# Altium schematic sheet Microcontroller.SchDoc
size 420 x 297 mm; Date: 10.01.2024; CheckedBy: Arda B.; DrawnBy: Arda Bozkurt; DocumentNumber: 4; Revision: 001; SheetNumber: 4; SheetTotal: 5; Department: HDD; Size: A3
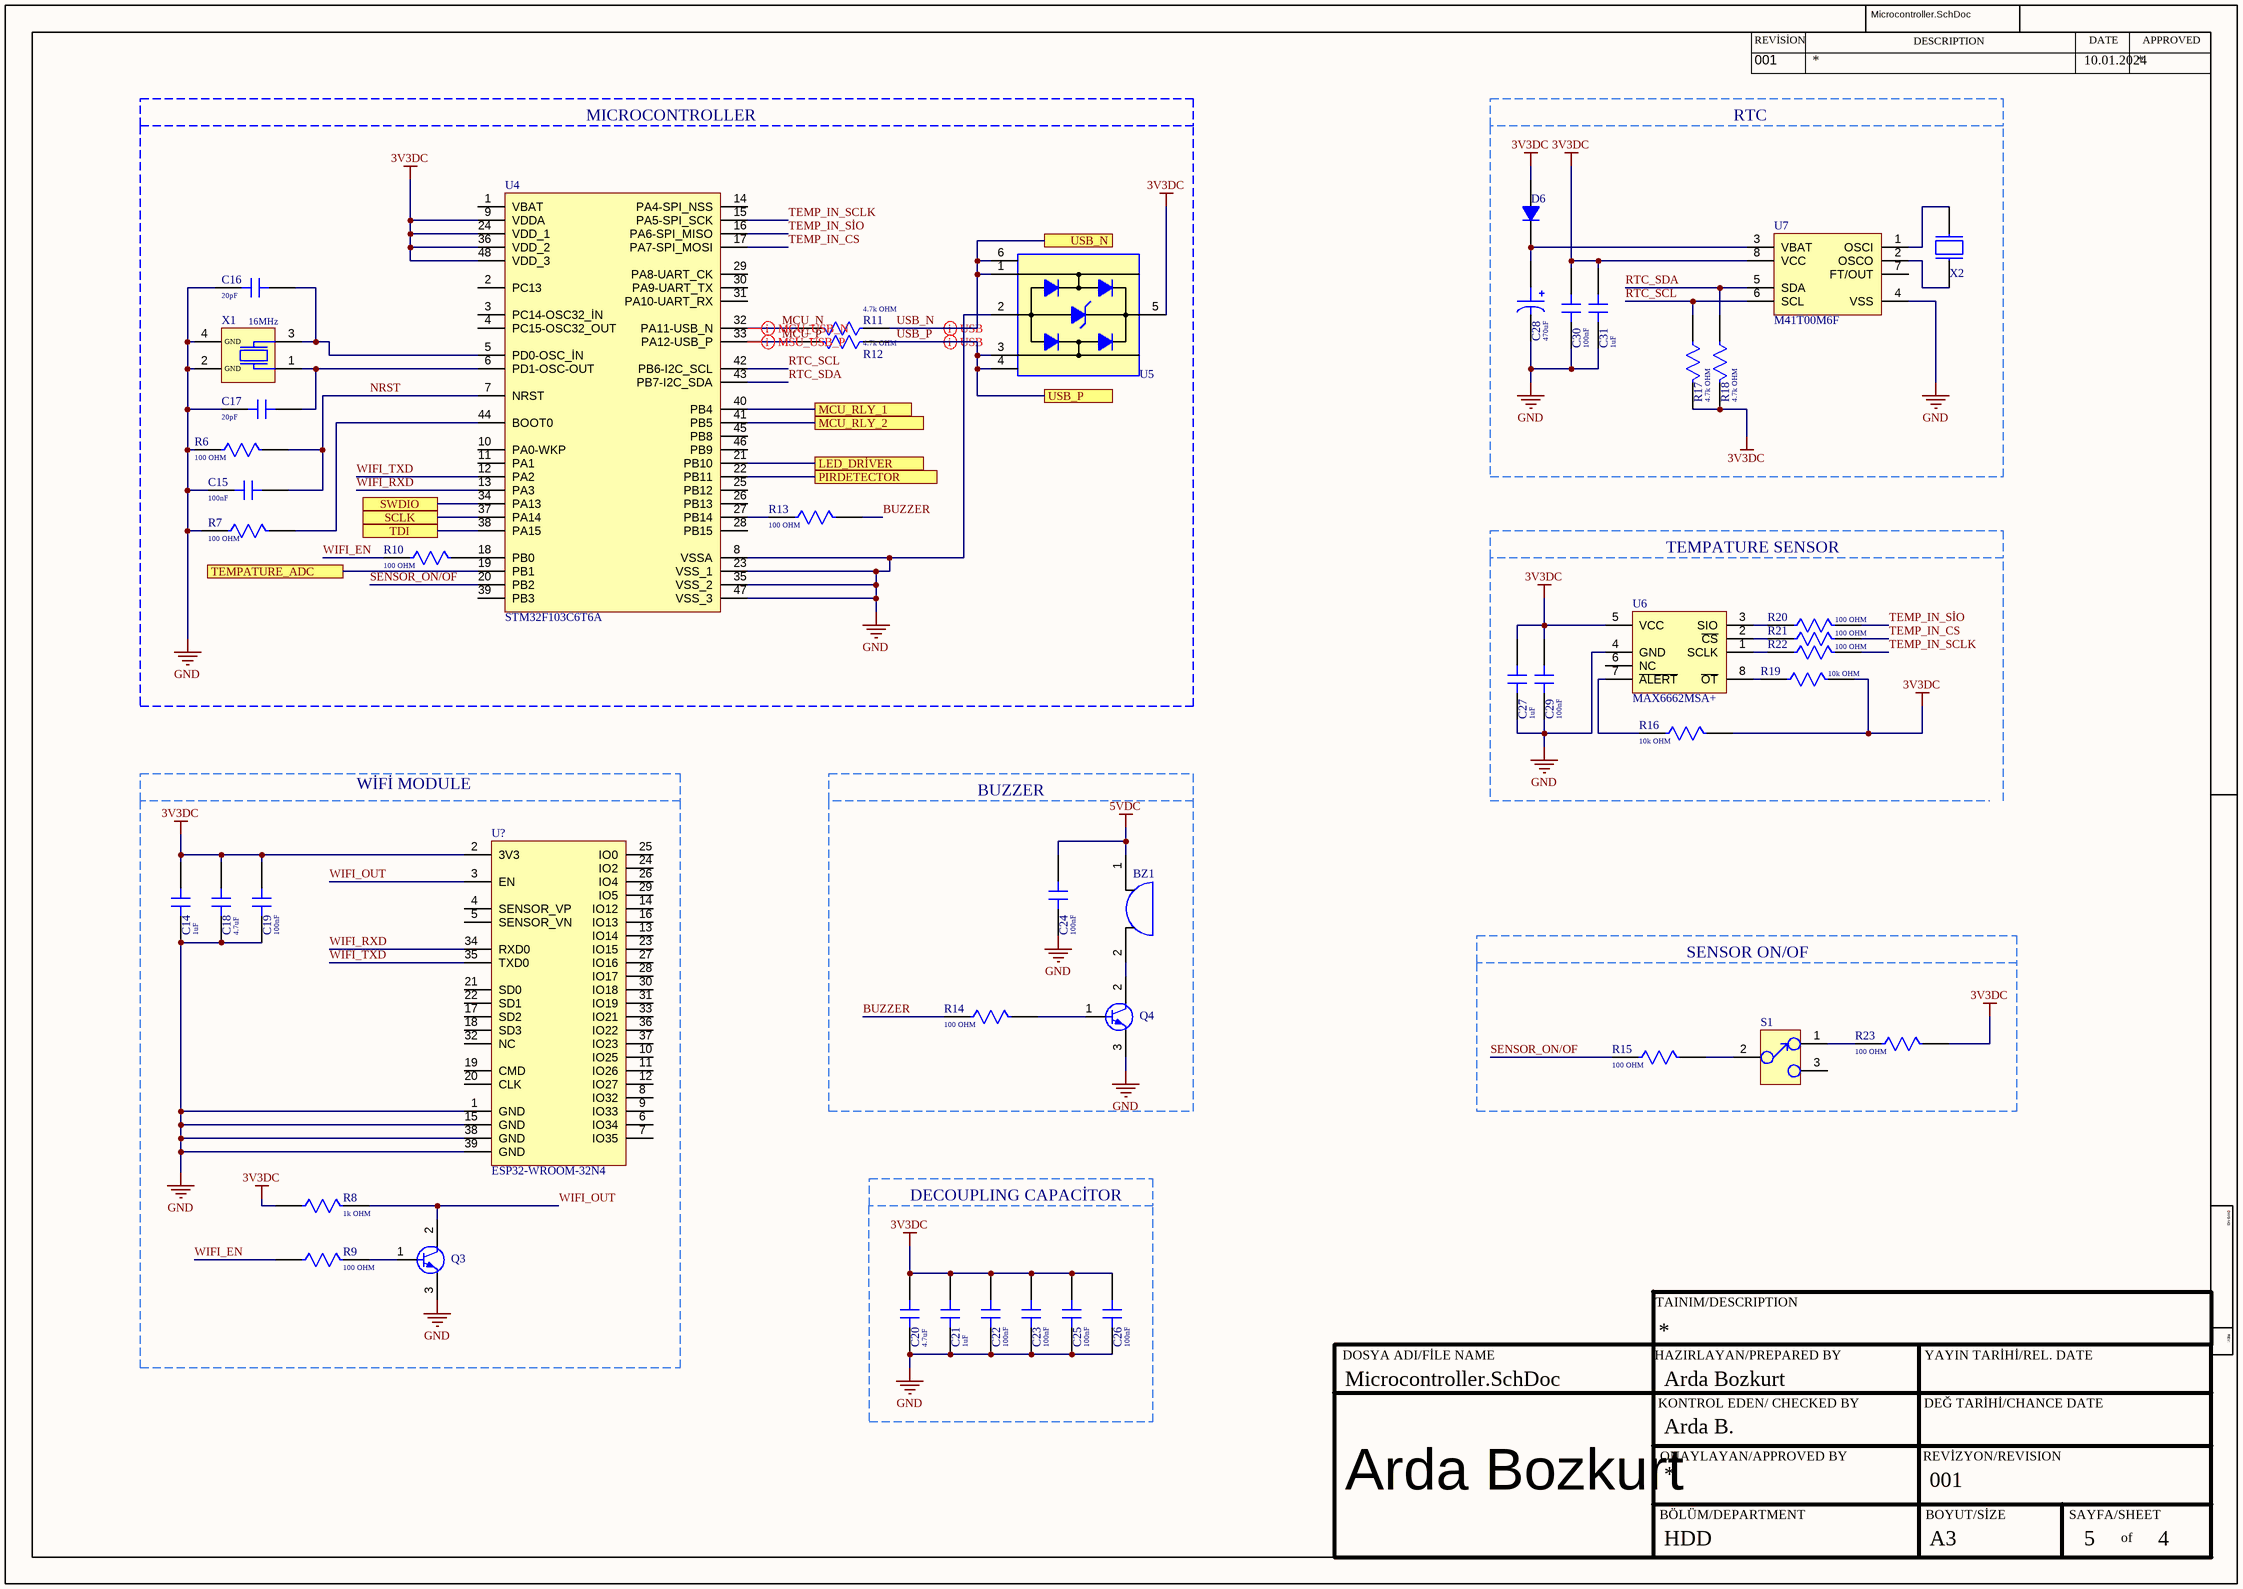
[diagram p0: Microcontroller.SchDoc]

## Parts
BZ1  CMI-9605IC-0580T  [CMI-9605IC-0580T]  (value not drawn)
C14  value 1uF  [CAP-0805]  (hidden comment: CL21B105KAFNNNE)
C15  value 100nF  [CAP-0603]  (hidden comment: C0603C104KRACTU)
C16  value 20pF  [CAP-0603]  (hidden comment: 0603N200J500CT)
C17  value 20pF  [CAP-0603]  (hidden comment: 0603N200J500CT)
C18  value 4.7uF  [CAP-0805]  (hidden comment: CL21A475KAQNNNE)
C19  value 100nF  [CAP-0805]  (hidden comment: 08055C104KAT2A)
C20  value 4.7uF  [CAP-0805]  (hidden comment: CL21A475KAQNNNE)
C21  value 1uF  [CAP-0805]  (hidden comment: CL21B105KAFNNNE)
C22  value 100nF  [CAP-0805]  (hidden comment: 08055C104KAT2A)
C23  value 100nF  [CAP-0805]  (hidden comment: 08055C104KAT2A)
C24  value 100nF  [CAP-0805]  (hidden comment: 08055C104KAT2A)
C25  value 100nF  [CAP-0805]  (hidden comment: 08055C104KAT2A)
C26  value 100nF  [CAP-0805]  (hidden comment: 08055C104KAT2A)
C27  value 1uF  [CAP-0805]  (hidden comment: CL21B105KAFNNNE)
C28  value 470uF  [CAP_RADİAL_D1_PS]  (hidden comment: ESH477M050AH4AA)
C29  value 100nF  [CAP-0805]  (hidden comment: 08055C104KAT2A)
C30  value 100nF  [CAP-0805]  (hidden comment: 08055C104KAT2A)
C31  value 1uF  [CAP-0805]  (hidden comment: CL21B105KAFNNNE)
D6  1N4148WS  [SOT-323]  (value not drawn)
Q3  MMBT3904-7-F  [SOT23-3]  (value not drawn)
Q4  MMBT3904-7-F  [SOT23-3]  (value not drawn)
R6  value 100 OHM  [RES-0603]  (hidden comment: RMCF0603FT100R)
R7  value 100 OHM  [RES-0603]  (hidden comment: RMCF0603FT100R)
R8  value 1k OHM  [RES-0603]  (hidden comment: RMCF0603FT1K00)
R9  value 100 OHM  [RES-0603]  (hidden comment: RMCF0603FT100R)
R10  value 100 OHM  [RES-0603]  (hidden comment: RMCF0603FT100R)
R11  value 4.7k OHM  [RES-0603]  (hidden comment: RMCF0603FT4K70)
R12  value 4.7k OHM  [RES-0603]  (hidden comment: RMCF0603FT4K70)
R13  value 100 OHM  [RES-0603]  (hidden comment: RMCF0603FT100R)
R14  value 100 OHM  [RES-0603]  (hidden comment: RMCF0603FT100R)
R15  value 100 OHM  [RES-0603]  (hidden comment: RMCF0603FT100R)
R16  value 10k OHM  [RES-0603]  (hidden comment: RC0603FR-0710KL)
R17  value 4.7k OHM  [RES-0603]  (hidden comment: RMCF0603FT4K70)
R18  value 4.7k OHM  [RES-0603]  (hidden comment: RMCF0603FT4K70)
R19  value 10k OHM  [RES-0603]  (hidden comment: RC0603FR-0710KL)
R20  value 100 OHM  [RES-0603]  (hidden comment: RMCF0603FT100R)
R21  value 100 OHM  [RES-0603]  (hidden comment: RMCF0603FT100R)
R22  value 100 OHM  [RES-0603]  (hidden comment: RMCF0603FT100R)
R23  value 100 OHM  [RES-0603]  (hidden comment: RMCF0603FT100R)
S1  EG1215AA  [SWİCH SLİDE]  (value not drawn)
U4  STM32F103C6T6A  [LQFP48]
U5  USBLC6-2SC6  [SOT23-6]  (value not drawn)
U6  MAX6662MSA+  [SO8]
U7  M41T00M6F  [SO8]
U?  ESP32-WROOM-32N4  [ESP32­WROOM­32-N4]
X1  Frequency: 16MHz  [ECX_53b]  (hidden comment: ECS-160-20-30B-TR)
X2  ABS05-32.768KHZ-T  [ABS05]  (value not drawn)

## Blocks framed on the sheet
MICROCONTROLLER: C15-C17 R6 R7 R10-R13 U4 U5 X1
RTC: C28 C30 C31 D6 R17 R18 U7 X2
WİFİ MODULE: C14 C18 C19 Q3 R8 R9 U?
BUZZER: BZ1 C24 Q4 R14
SENSOR ON/OF: R15 R23 S1
DECOUPLING CAPACİTOR: C20-C23 C25 C26

## Ports
LED_DRİVER (see Power Manengement[3D]), MCU_RLY_1 (see Power Manengement[4A]), MCU_RLY_2 (see Power Manengement[4B]), PIRDETECTOR (see Power Manengement[3D]), SCLK (see Power Manengement[5C]), SWDIO (see Power Manengement[5C]), TDI (see Power Manengement[5C]), TEMPATURE_ADC (see Power Manengement[3D]), USB_N (see Power Manengement[5C]), USB_P (see Power Manengement[5C])

## Nets
3V3DC: C14.2 C18.2 C19.2 C20.2 C21.2 C22.2 C23.2 C25.2 C26.2 C27.2 C29.2 C30.2 C31.2 D6.2 R8.1 R16.2 R17.2 R18.2 R19.2 R23.2 U4.9(VDDA) U4.24(VDD_1) U4.36(VDD_2) U4.48(VDD_3) U5.5(VBUS) U6.5(VCC) U7.8(VCC) U?.2(3V3)
5VDC: BZ1.1 C24.2
GND: C14.1 C15.1 C16.1 C17.1 C18.1 C19.1 C20.1 C21.1 C22.1 C23.1 C24.1 C25.1 C26.1 C27.1 C28.2 C29.1 C30.1 C31.1 Q3.3(E) Q4.3(E) R6.1 R7.1 U4.8(VSSA) U4.23(VSS_1) U4.35(VSS_2) U4.47(VSS_3) U5.2(GND) U6.4(GND) U7.4(VSS) U?.1(GND) U?.15(GND) U?.38(GND) U?.39(GND) X1.2(GND) X1.4(GND)
BUZZER: R13.2 R14.1
LED_DRİVER: U4.21(PB10) ; port LED_DRİVER
MCU_N: R11.2 U4.32(PA11-USB_N)
MCU_P: R12.2 U4.33(PA12-USB_P)
MCU_RLY_1: U4.40(PB4) ; port MCU_RLY_1
MCU_RLY_2: U4.41(PB5) ; port MCU_RLY_2
NRST: C15.2 R6.2 U4.7(NRST)
PIRDETECTOR: U4.22(PB11) ; port PIRDETECTOR
RTC_SCL: R17.1 U4.42(PB6-I2C_SCL) U7.6(SCL)
RTC_SDA: R18.1 U4.43(PB7-I2C_SDA) U7.5(SDA)
SCLK: U4.37(PA14) ; port SCLK
SENSOR_ON/OF: R15.1 U4.20(PB2)
SWDIO: U4.34(PA13) ; port SWDIO
TDI: U4.38(PA15) ; port TDI
TEMP_IN_CS: R21.2 U4.17(PA7-SPI_MOSI)
TEMP_IN_SCLK: R22.2 U4.15(PA5-SPI_SCK)
TEMP_IN_SİO: R20.2 U4.16(PA6-SPI_MISO)
TEMPATURE_ADC: U4.19(PB1) ; port TEMPATURE_ADC
USB_N: R11.1 U5.1(I/O1) U5.6(I/O1) ; port USB_N
USB_P: R12.1 U5.3(I/O2) U5.4(I/O2) ; port USB_P
WIFI_EN: R9.1 R10.2
WIFI_OUT: Q3.2(C) R8.2 U?.3(EN)
WIFI_RXD: U4.13(PA3) U?.34(RXD0)
WIFI_TXD: U4.12(PA2) U?.35(TXD0)
NetBZ1_2: BZ1.2 Q4.2(C)
NetC16_2: C16.2 U4.5(PD0-OSC_İN) X1.3
NetC17_2: C17.2 U4.6(PD1-OSC-OUT) X1.1
NetC28_1: C28.1 D6.1 U7.3(VBAT)
NetQ3_1: Q3.1(B) R9.2
NetQ4_1: Q4.1(B) R14.2
NetR7_2: R7.2 U4.44(BOOT0)
NetR10_1: R10.1 U4.18(PB0)
NetR13_1: R13.1 U4.27(PB14)
NetR15_2: R15.2 S1.2
NetR16_1: R16.1 U6.7(~{ALERT})
NetR19_1: R19.1 U6.8(~{OT})
NetR20_1: R20.1 U6.3(SIO)
NetR21_1: R21.1 U6.2(~{CS})
NetR22_1: R22.1 U6.1(SCLK)
NetR23_1: R23.1 S1.1
NetU7_1: U7.1(OSCI) X2.1
NetU7_2: U7.2(OSCO) X2.2

Not connected (* = marked no-connect by the designer): S1 3; U4 1(VBAT) 2(PC13) 3(PC14-OSC32_İN) 4(PC15-OSC32_OUT) 10(PA0-WKP) 11(PA1) 14(PA4-SPI_NSS) 25(PB12) 26(PB13) 28(PB15) 29(PA8-UART_CK) 30(PA9-UART_TX) 31(PA10-UART_RX) 39(PB3) 45(PB8) 46(PB9); U6 6(NC); U7 7(FT/OUT); U? 4(SENSOR_VP) 5(SENSOR_VN) 6(IO34) 7(IO35) 8(IO32) 9(IO33) 10(IO25) 11(IO26) 12(IO27) 13(IO14) 14(IO12) 16(IO13) 17(SD2) 18(SD3) 19(CMD) 20(CLK) 21(SD0) 22(SD1) 23(IO15) 24(IO2) 25(IO0) 26(IO4) 27(IO16) 28(IO17) 29(IO5) 30(IO18) 31(IO19) 32(NC) 33(IO21) 36(IO22) 37(IO23)

## Layout directives
differential pair: MCU_N, MCU_P, USB_N, USB_P

## Notes on the sheet
- TEMPATURE SENSOR
- REVİSİON
- DESCRIPTION
- DATE
- APPROVED
- DWG NO:
- TAINIM/DESCRIPTION
- REV:
- DOSYA ADI/FİLE NAME
- HAZIRLAYAN/PREPARED BY
- KONTROL EDEN/ CHECKED BY
- YAYIN TARİHİ/REL. DATE
- DEĞ TARİHİ/CHANCE DATE
- ONAYLAYAN/APPROVED BY
- REVİZYON/REVISION
- Arda Bozkurt
- BÖLÜM/DEPARTMENT
- BOYUT/SİZE
- SAYFA/SHEET
- of

## Library data of the parts
BZ1 = CMI-9605IC-0580T: Audio Buzzer Magnetic 3VDC 7VDC 30mA 5VDC 85dB 2600Hz to 2800Hz Through Hole Pin Box; Manufacturer: CUI Devices; Des,gned By: Arda B.; Supplier: Digi-Key; Supplier Part Number: 2223-CMI-9605IC-0580T-ND; Manufacturer Part Number: CMI-9605IC-0580T; RoHS: No; Category: Audio Products; Stock: 5910; Pricing: 1=1,22, 10=1,014, 25=0,938, 50=0,883, 100=0,8298, 250=0,76976, 500=0,71396, 1000=0,66741, 5000=0,65403 (USD)
C14 C21 C27 C31 = CAP CER 1uF 0805: Multilayer Ceramic Capacitor, 1 uF, 25 V, ± 10%, X7R, 0805 [2012 Metric]; Manufacturer: Samsung; Voltage: 25V; Designed By: Arda B.; Supplier: Digi-Key; Supplier Part Number: 1276-1066-6-ND; Manufacturer Part Number: CL21B105KAFNNNE; RoHS: Yes; Category: Ceramic Capacitors; Stock: 1108684; Pricing: 1=0,1, 10=0,062, 50=0,0356, 100=0,0276, 500=0,02078, 1000=0,01633 (USD); Mounting Technology: Surface Mount; Case/Package: 0805; Case Code (Metric): 2012; Case Code (Imperial): 0805; Min Operating Temperature: -55°C; Max Operating Temperature: 125°C; Tolerance: 10%; Dielectric: X7R; Voltage Rating (DC): 25V; Series: CL; Packaging: Tape and Reel; Voltage Rating: 25V; Package Quantity: 1; Construction: Flat; Length: 2mm; Width: 0.049inch; Height: 1.25mm; Depth: 1.25mm; Thickness: 0.053inch; Radiation Hardening: No; Lead Free: Lead Free; RoHS Compliant: Yes; ComponentLink1URL: https://datasheet.ciiva.com/25800/cl21b105kafnnne-25800163.pdf?src-supplier=Digi-Key; ComponentLink1Description: https://datasheet.ciiva.com/25800/cl21b105kafnnne-25800163.pdf?src-supplier=Digi-Key; ComponentLink2URL: https://datasheet.ciiva.com/15195/getdatasheetpartid-355205-15195880.pdf?src-supplier=Verical; ComponentLink2Description: https://datasheet.ciiva.com/15195/getdatasheetpartid-355205-15195880.pdf?src-supplier=Verical
C15 = CAP CER 100nF 0603: Capacitor, 0.1UF, 100V, MLCC, 0603;; Manufacturer: KEMET; Manufacturer Part Number: C0603C104K1RACTU; Dielectric: 1511DielectricType; Designed By: Arda B.; Supplier: Digi-Key; Supplier Part Number: 399-C0603C104K1RACTUCT-ND; RoHS: No; Category: Ceramic Capacitors; Stock: 4405; Pricing: 1=0,28, 10=0,185, 50=0,1296, 100=0,1047, 500=0,07782, 1000=0,06808 (USD); Case/Package: 345Case; Voltage Rating (DC): 100V
C16 C17 = CAP CER 20pF 0603: 0603 20 pF 50 V ±5 % Tolerance C0G/NP0 SMT Multilayer Ceramic Capacitor; Manufacturer: Walsin Technologies; Designed By: Arda B.; Supplier: Digi-Key; Supplier Part Number: 1292-1498-1-ND; Manufacturer Part Number: 0603N200J500CT; RoHS: Yes; Category: Ceramic Capacitors; Stock: 42580; Pricing: 1=0,1, 10=0,035, 50=0,02, 100=0,0155, 500=0,01166, 1000=0,00917 (USD); ComponentLink1URL: http://www.farnell.com/datasheets/2340522.pdf?src-supplier=Farnell; ComponentLink1Description: http://www.farnell.com/datasheets/2340522.pdf?src-supplier=Farnell; ComponentLink2URL: https://datasheet.octopart.com/0603N200J500CT-Walsin-Technologies-datasheet-85392065.pdf?src-supplier=Element14; ComponentLink2Description: https://datasheet.octopart.com/0603N200J500CT-Walsin-Technologies-datasheet-85392065.pdf?src-supplier=Element14; ComponentLink3URL: http://www.farnell.com/datasheets/2340522.pdf?src-supplier=Newark; ComponentLink3Description: http://www.farnell.com/datasheets/2340522.pdf?src-supplier=Newark; ComponentLink4URL: http://www.passivecomponent.com/wp-content/uploads/2018/10/MLCC.pdf?src-supplier=Digi-Key; ComponentLink4Description: http://www.passivecomponent.com/wp-content/uploads/2018/10/MLCC.pdf?src-supplier=Digi-Key; ComponentLink5URL: https://datasheet.octopart.com/0603N200J500CT-Walsin-Technologies-datasheet-128065749.pdf?src-supplier=Future+Electronics; ComponentLink5Description: https://datasheet.octopart.com/0603N200J500CT-Walsin-Technologies-datasheet-128065749.pdf?src-supplier=Future+Electronics; ComponentLink6URL: https://datasheet.octopart.com/0603N200J500CT-Walsin-Technologies-datasheet-136037192.pdf?src-supplier=TECHDesign; ComponentLink6Description: https://datasheet.octopart.com/0603N200J500CT-Walsin-Technologies-datasheet-136037192.pdf?src-supplier=TECHDesign
C18 C20 = CAP CER 4.7uF 0805: Multilayer Ceramic Capacitor, 4.7 uF, 25 V, ± 10%, X5R, 0805 [2012 Metric]; Manufacturer: Samsung; Voltage Rating: 25V; Designed By: Arda B.; Supplier: Digi-Key; Supplier Part Number: 1276-1244-1-ND; Manufacturer Part Number: CL21A475KAQNNNE; RoHS: Yes; Category: Ceramic Capacitors; Stock: 3410220; Pricing: 1=0,1, 10=0,069, 50=0,0414, 100=0,0326, 500=0,02408, 1000=0,01994 (USD); Mounting Technology: Surface Mount; Case/Package: 0805; Case Code (Metric): 2012; Case Code (Imperial): 0805; Material: Ceramic; Min Operating Temperature: -55°C; Max Operating Temperature: 85°C; Packaging: Tape and Reel; Tolerance: 10%; Dielectric: X5R; Voltage Rating (DC): 25V; Series: CL; Construction: Flat; Length: 2mm; Height: 1.25mm; Depth: 1.25mm; Radiation Hardening: No; Lead Free: Lead Free; RoHS Compliant: Yes; ComponentLink1URL: https://datasheet.ciiva.com/25798/cl21a475kaqnnne-25798882.pdf?src-supplier=Digi-Key; ComponentLink1Description: https://datasheet.ciiva.com/25798/cl21a475kaqnnne-25798882.pdf?src-supplier=Digi-Key
C19 C22-C26 C29 C30 = CAP CER 100nF 0805: Multilayer Ceramic Capacitor, 0.1 uF, 50 V, ± 10%, X7R, 0805 [2012 Metric]; Manufacturer: Kyocera AVX; Designed By: Arda B.; Material: 4241ConductorMaterial; Voltage Rating (DC): 50V; Supplier: Arrow Electronics; Supplier Part Number: 08055C104KAT2A; Manufacturer Part Number: 08055C104KAT2A; RoHS: Yes; Category: Ceramic Capacitors; Stock: 4448000; Pricing: 4000=0,0139, 8000=0,0127, 12000=0,0121, 20000=0,012, 24000=0,0115, 100000=0,0076 (USD); Case/Package: 0805; Case Code (Metric): 2012; Case Code (Imperial): 0805; Dielectric Material: Ceramic; Weight: 0.001411oz; Min Operating Temperature: -55°C; Max Operating Temperature: 125°C; Tolerance: 10%; Dielectric: X7R; Packaging: Cut Tape; Package Quantity: 4000; Termination: Standard; Voltage: 50V; Series: MLCC X7R; Voltage Rating (AC): 50V; Length: 2mm; Width: 1.2mm; Height: 0.5mm; Lead Free: Lead Free; RoHS Compliant: Yes; ComponentLink1URL: https://datasheet.ciiva.com/19475/2009691-19475858.pdf?src-supplier=Jameco; ComponentLink1Description: https://datasheet.ciiva.com/19475/2009691-19475858.pdf?src-supplier=Jameco; ComponentLink2URL: https://datasheet.ciiva.com/11786/0900766b802d4698-11786116.pdf?src-supplier=Rs; ComponentLink2Description: https://datasheet.ciiva.com/11786/0900766b802d4698-11786116.pdf?src-supplier=Rs; ComponentLink3URL: https://datasheet.ciiva.com/5416/cx7r-5416959.pdf?src-supplier=Mouser; ComponentLink3Description: https://datasheet.ciiva.com/5416/cx7r-5416959.pdf?src-supplier=Mouser; ComponentLink4URL: https://datasheet.ciiva.com/2988/cx7r-2988014.pdf?src-supplier=Avnet; ComponentLink4Description: https://datasheet.ciiva.com/2988/cx7r-2988014.pdf?src-supplier=Avnet; ComponentLink5URL: https://datasheet.ciiva.com/16199/cx7r-16199014.pdf?src-supplier=Future+Electronics; ComponentLink5Description: https://datasheet.ciiva.com/16199/cx7r-16199014.pdf?src-supplier=Future+Electronics; ComponentLink6URL: https://datasheet.ciiva.com/11504/cx7r-11504044.pdf?src-supplier=Avnet; ComponentLink6Description: https://datasheet.ciiva.com/11504/cx7r-11504044.pdf?src-supplier=Avnet; ComponentLink7URL: https://datasheet.ciiva.com/150/cx7r-150258.pdf?src-supplier=Digi-Key; ComponentLink7Description: https://datasheet.ciiva.com/150/cx7r-150258.pdf?src-supplier=Digi-Key; ComponentLink8URL: https://datasheet.ciiva.com/150/cx7r-150257.pdf?src-supplier=Digi-Key; ComponentLink8Description: https://datasheet.ciiva.com/150/cx7r-150257.pdf?src-supplier=Digi-Key; ComponentLink9URL: https://datasheet.ciiva.com/150/cx7r-150259.pdf?src-supplier=Digi-Key; ComponentLink9Description: https://datasheet.ciiva.com/150/cx7r-150259.pdf?src-supplier=Digi-Key; ComponentLink10URL: https://datasheet.ciiva.com/7812/cx7r-7812079.pdf?src-supplier=Element14; ComponentLink10Description: https://datasheet.ciiva.com/7812/cx7r-7812079.pdf?src-supplier=Element14
C28 = CAP ALUM  POL 470UF: Cap, 470UF, 50V, Alu Elec, Radial; Manufacturer: KEMET; Supplier: Mouser; Supplier Part Number: 80-ESH477M050AH4AA; Manufacturer Part Number: ESH477M050AH4AA; RoHS: Yes; Stock: 7720; Pricing: 1=0,57, 10=0,32, 50=0,32, 100=0,215, 1000=0,165, 10000=0,149 (USD); ComponentLink1URL: https://api.kemet.com/component-edge/download/datasheet/ESH477M050AH4AA.pdf?src-supplier=Digikey; ComponentLink1Description: https://api.kemet.com/component-edge/download/datasheet/ESH477M050AH4AA.pdf?src-supplier=Digikey; ComponentLink2URL: https://datasheet.octopart.com/ESH477M050AH4AA-KEMET-datasheet-130075338.pdf?src-supplier=Newark; ComponentLink2Description: https://datasheet.octopart.com/ESH477M050AH4AA-KEMET-datasheet-130075338.pdf?src-supplier=Newark
D6 = DIODE  75V 150MA SOD323F: Diode Ultra Fast Recovery Rectifier 75V 0.15A 2-Pin SOD-323F T/R; Manufacturer: ON Semiconductor / Fairchild; Max Forward Surge Current (Ifsm): 2A; Forward Current: 150mA; Max Reverse Current: 5uA; Value: 4pF; Reverse Recovery Time: 4ns; Element Configuration: Single; Designed By: Arda B.; Supplier: Digi-Key; Supplier Part Number: 1N4148WSFSCT-ND; Manufacturer Part Number: 1N4148WS; RoHS: Yes; Category: Rectifier Diodes; Stock: 1155588; Pricing: 1=0,19, 10=0,136, 100=0,0733, 500=0,0576, 1000=0,04 (USD); Mounting Technology: Surface Mount; Pins: 2; Weight: 0.0276g; Min Operating Temperature: -55°C; Max Operating Temperature: 150°C; Packaging: Tape and Reel; Average Rectified Current: 150mA; Max Repetitive Reverse Voltage (Vrrm): 75V; Max Reverse Voltage (DC): 75V; Series: -; Package Quantity: 1; Reverse Voltage: 75V; Recovery Time: 4ns; Length: 1.8mm; Width: 1.35mm; Height: 1mm; Radiation Hardening: No; RoHS Compliant: Yes; Reach SVHC Compliant: No; Lead Free: Lead Free; ComponentLink1URL: https://datasheet.ciiva.com/15208/getdatasheetpartid-127819-15208358.pdf?src-supplier=Verical; ComponentLink1Description: https://datasheet.ciiva.com/15208/getdatasheetpartid-127819-15208358.pdf?src-supplier=Verical; ComponentLink2URL: https://datasheet.ciiva.com/8300/1n914bws-8300360.pdf?src-supplier=Avnet; ComponentLink2Description: https://datasheet.ciiva.com/8300/1n914bws-8300360.pdf?src-supplier=Avnet; ComponentLink3URL: https://datasheet.ciiva.com/910/1n4148ws-910381.pdf?src-supplier=Digi-Key; ComponentLink3Description: https://datasheet.ciiva.com/910/1n4148ws-910381.pdf?src-supplier=Digi-Key; ComponentLink4URL: https://datasheet.ciiva.com/910/1n4148ws-910382.pdf?src-supplier=Digi-Key; ComponentLink4Description: https://datasheet.ciiva.com/910/1n4148ws-910382.pdf?src-supplier=Digi-Key; ComponentLink5URL: https://datasheet.ciiva.com/910/1n4148ws-910380.pdf?src-supplier=Digi-Key; ComponentLink5Description: https://datasheet.ciiva.com/910/1n4148ws-910380.pdf?src-supplier=Digi-Key
Q3 Q4 = MMBT3904-7-F: Transistor General Purpose BJT NPN 40 Volt 0.2A Automotive 3-Pin SOT-23; Manufacturer: Diodes Zetex; Designed By: Arda B.; Max Power Dissipation: 300mW; Collector Emitter Voltage (VCEO): 40V; Max Collector Current: 200mA; Collector Base Voltage (VCBO): 60V; Power Dissipation: 350mW; Frequency: 300MHz; hFE Min: 100; Number of Elements: 1; Emitter Base Voltage (VEBO): 6V; Collector Emitter Saturation Voltage: 300mV; Supplier: Digi-Key; Supplier Part Number: MMBT3904-FDICT-ND; Manufacturer Part Number: MMBT3904-7-F; RoHS: Yes; Category: BJTs; Stock: 5390800; Pricing: 1=0,12, 10=0,086, 100=0,0467, 500=0,03666, 1000=0,02545 (USD); Mounting Technology: Surface Mount; Case/Package: SOT-23; Pins: 3; Weight: 0.000282oz; Min Operating Temperature: -55°C; Max Operating Temperature: 150°C; Polarity: NPN; Packaging: Tape and Reel; Package Quantity: 3000; Transition Frequency: 300MHz; Collector Emitter Breakdown Voltage: 40V; Max Breakdown Voltage: 40V; Continuous Collector Current: 200mA; Clock Frequency: 300MHz; Gain Bandwidth Product: 300MHz; Voltage Rating (DC): 40V; Series: Automotive, AEC-Q101; Collector-emitter Voltage-Max: 300mV; Length: 3.05mm; Width: 1.4mm; Height: 1mm; Radiation Hardening: No; Reach SVHC Compliant: No; Lead Free: Lead Free; RoHS Compliant: Yes; ComponentLink1URL: https://datasheet.ciiva.com/11201/ds30036-11201778.pdf?src-supplier=Avnet; ComponentLink1Description: https://datasheet.ciiva.com/11201/ds30036-11201778.pdf?src-supplier=Avnet; ComponentLink2URL: https://datasheet.ciiva.com/15138/getdatasheetpartid-53265-15138780.pdf?src-supplier=Verical; ComponentLink2Description: https://datasheet.ciiva.com/15138/getdatasheetpartid-53265-15138780.pdf?src-supplier=Verical; ComponentLink3URL: https://datasheet.ciiva.com/22711/1915516-22711750.pdf?src-supplier=Element14; ComponentLink3Description: https://datasheet.ciiva.com/22711/1915516-22711750.pdf?src-supplier=Element14; ComponentLink4URL: https://datasheet.ciiva.com/11198/ds30036-11198999.pdf?src-supplier=Avnet; ComponentLink4Description: https://datasheet.ciiva.com/11198/ds30036-11198999.pdf?src-supplier=Avnet; ComponentLink5URL: https://datasheet.ciiva.com/6361/ds30036-6361256.pdf?src-supplier=Digi-Key; ComponentLink5Description: https://datasheet.ciiva.com/6361/ds30036-6361256.pdf?src-supplier=Digi-Key; ComponentLink6URL: https://datasheet.ciiva.com/6361/ds30036-6361254.pdf?src-supplier=Digi-Key; ComponentLink6Description: https://datasheet.ciiva.com/6361/ds30036-6361254.pdf?src-supplier=Digi-Key
R6 R7 R9 R10 R13-R15 R20-R23 = RES 100 OHM 0603: Res Thick Film 0603 100 Ohm 1% 1/10W ±100ppm/°C Molded SMD SMD Paper T/R; Manufacturer: Stackpole Electronics; Designed By: Arda B.; Power Rating: 100mW; Voltage Rating: 75V; Supplier: Digi-Key; Supplier Part Number: RMCF0603FT100RCT-ND; Manufacturer Part Number: RMCF0603FT100R; RoHS: Yes; Category: Chip SMD Resistors; Stock: 1439446; Pricing: 1=0,1, 10=0,015, 50=0,009, 100=0,0075, 500=0,00498, 1000=0,00425 (USD); Mounting Technology: Surface Mount; Case/Package: 0603; Case Code (Metric): 1608; Case Code (Imperial): 0603; Contact Plating: Tin,Matte; Min Operating Temperature: -55°C; Max Operating Temperature: 155°C; Tolerance: 1%; Packaging: Tape and Reel; Number of Terminations: 2; Max Power Dissipation: 100mW; Temperature Coefficient: 100ppm/°C; Features: Automotive AEC-Q200; Series: RMCF; Construction: Rectangular; Length: 0.061inch; Width: 0.031inch; Height: 0.022inch; Depth: 0.8mm; Ratings: AEC-Q200; Radiation Hardening: No; Military Standard: Not; Lead Free: Lead Free; RoHS Compliant: Yes; ComponentLink1URL: https://datasheet.ciiva.com/15215/getdatasheetpartid-360413-15215981.pdf?src-supplier=Verical; ComponentLink1Description: https://datasheet.ciiva.com/15215/getdatasheetpartid-360413-15215981.pdf?src-supplier=Verical
R8 = RES 1K OHM 0603: Res Thick Film 0603 1K Ohm 1% 0.1W(1/10W) ±100ppm/C Pad SMD Automotive T/R; Manufacturer: Stackpole Electronics; Designed By: Arda B.; Power Rating: 100mW; Temperature Coefficient: 100ppm/°C; Voltage Rating: 75V; Supplier: Digi-Key; Supplier Part Number: RMCF0603FT1K00CT-ND; Manufacturer Part Number: RMCF0603FT1K00; RoHS: Yes; Category: Chip SMD Resistors; Stock: 2889922; Pricing: 1=0,1, 10=0,015, 50=0,009, 100=0,0075, 500=0,00498, 1000=0,00425 (USD); Mounting Technology: Surface Mount; Case/Package: 0603; Case Code (Metric): 1608; Case Code (Imperial): 0603; Contact Plating: Tin,Matte; Min Operating Temperature: -55°C; Max Operating Temperature: 155°C; Tolerance: 1%; Packaging: Tape and Reel; Number of Terminations: 2; Max Power Dissipation: 100mW; Features: Automotive AEC-Q200; Series: RMCF; Construction: Rectangular; Length: 1.55mm; Width: 0.031inch; Height: 0.022inch; Depth: 0.8mm; Radiation Hardening: No; Military Standard: Not; Lead Free: Lead Free; RoHS Compliant: Yes; ComponentLink1URL: https://datasheet.octopart.com/RMCF0603FT1K00-Stackpole-Electronics-datasheet-11547379.pdf?src-supplier=Future+Electronics; ComponentLink1Description: https://datasheet.octopart.com/RMCF0603FT1K00-Stackpole-Electronics-datasheet-11547379.pdf?src-supplier=Future+Electronics; ComponentLink2URL: https://www.seielect.com/catalog/SEI-Packaging.pdf?src-supplier=Avnet; ComponentLink2Description: https://www.seielect.com/catalog/SEI-Packaging.pdf?src-supplier=Avnet; ComponentLink3URL: https://www.seielect.com/catalog/SEI-Packaging.pdf?src-supplier=Arrow+Electronics; ComponentLink3Description: https://www.seielect.com/catalog/SEI-Packaging.pdf?src-supplier=Arrow+Electronics; ComponentLink4URL: http://www.seielect.com/Catalog/SEI-rmc.pdf?src-supplier=Future+Electronics; ComponentLink4Description: http://www.seielect.com/Catalog/SEI-rmc.pdf?src-supplier=Future+Electronics; ComponentLink5URL: https://www.seielect.com/catalog/SEI-Packaging.pdf?src-supplier=Verical; ComponentLink5Description: https://www.seielect.com/catalog/SEI-Packaging.pdf?src-supplier=Verical; ComponentLink6URL: https://www.seielect.com/catalog/SEI-RMCF_RMCP.pdf?src-supplier=Avnet; ComponentLink6Description: https://www.seielect.com/catalog/SEI-RMCF_RMCP.pdf?src-supplier=Avnet; ComponentLink7URL: https://www.seielect.com/catalog/sei-rmcf_rmcp.pdf?src-supplier=Digi-Key; ComponentLink7Description: https://www.seielect.com/catalog/sei-rmcf_rmcp.pdf?src-supplier=Digi-Key; ComponentLink8URL: https://www.seielect.com/catalog/SEI-Packaging.pdf?src-supplier=Quest; ComponentLink8Description: https://www.seielect.com/catalog/SEI-Packaging.pdf?src-supplier=Quest; ComponentLink9URL: https://datasheet.octopart.com/RMCF0603FT1K00-Stackpole-Electronics-datasheet-155966809.pdf?src-supplier=Master+Electronics; ComponentLink9Description: https://datasheet.octopart.com/RMCF0603FT1K00-Stackpole-Electronics-datasheet-155966809.pdf?src-supplier=Master+Electronics
R11 R12 R17 R18 = RES 4.7k OHM 0603: Res Thick Film 0603 4.7K Ohm 1% 1/10W ±100ppm/°C Molded SMD SMD Paper T/R; Manufacturer: Stackpole Electronics; Designed By: Arda B.; Max Power Dissipation: 100mW; Supplier: Digi-Key; Supplier Part Number: RMCF0603FT4K70CT-ND; Manufacturer Part Number: RMCF0603FT4K70; RoHS: Yes; Category: Chip SMD Resistors; Stock: 1510481; Pricing: 1=0,1, 10=0,015, 50=0,009, 100=0,0075, 500=0,00498, 1000=0,00425 (USD); Mounting Technology: Surface Mount; Case/Package: 0603; Case Code (Metric): 1608; Case Code (Imperial): 0603; Contact Plating: Tin,Matte; Min Operating Temperature: -55°C; Max Operating Temperature: 155°C; Packaging: Tape and Reel; Tolerance: 1%; Number of Terminations: 2; Temperature Coefficient: 100ppm/°C; Features: Automotive AEC-Q200; Series: RMCF; Construction: Rectangular; Length: 0.061inch; Width: 0.031inch; Height: 0.022inch; Depth: 0.8mm; Radiation Hardening: No; Military Standard: Not; Lead Free: Lead Free; RoHS Compliant: Yes; ComponentLink1URL: https://datasheet.ciiva.com/26835/getdatasheetpartid-486078-26835642.pdf?src-supplier=Verical; ComponentLink1Description: https://datasheet.ciiva.com/26835/getdatasheetpartid-486078-26835642.pdf?src-supplier=Verical
R16 R19 = RES 10K OHM 0603: SMD Chip Resistor, 10 kOhm, ± 1%, 100 mW, 0603 [1608 Metric], Thick Film, General Purpose; Manufacturer: Yageo; Voltage Rating (DC): 50V; Temperature Coefficient: 100ppm/°C; Power Rating: 100mW; Voltage Rating: 75V; Designed By: Arda B.; Supplier: Digi-Key; Supplier Part Number: 311-10.0KHRCT-ND; Manufacturer Part Number: RC0603FR-0710KL; RoHS: Yes; Category: Chip SMD Resistors; Stock: 24703208; Pricing: 1=0,1, 10=0,019, 50=0,0112, 100=0,0093, 500=0,00622, 1000=0,00532 (USD); Case/Package: 0603; Pins: 2; Case Code (Imperial): 0603; Case Code (Metric): 1608; Weight: 7.1E-05oz; Min Operating Temperature: -55°C; Max Operating Temperature: 155°C; Tolerance: 1%; Resistor Type: Thick Film; Packaging: Tape and Reel; Termination: SMD/SMT; Features: Moisture Resistant; Series: RC; Max Power Dissipation: 100mW; Number of Terminations: 2; Resistance Tolerance: 1%; Construction: Rectangular; Length: 1.6mm; Width: 0.8mm; Height: 0.45mm; Depth: 0.8mm; Lead Pitch: 0.3mm; Reach SVHC Compliant: No; Lead Free: 5697LeadFree; Military Standard: Not; RoHS Compliant: Yes; ComponentLink1URL: https://datasheet.ciiva.com/7660/38590-7660789.pdf?src-supplier=Element14; ComponentLink1Description: https://datasheet.ciiva.com/7660/38590-7660789.pdf?src-supplier=Element14; ComponentLink2URL: https://datasheet.ciiva.com/7983/443971-7983596.pdf?src-supplier=Element14; ComponentLink2Description: https://datasheet.ciiva.com/7983/443971-7983596.pdf?src-supplier=Element14; ComponentLink3URL: https://datasheet.ciiva.com/22747/443971-22747519.pdf?src-supplier=Element14; ComponentLink3Description: https://datasheet.ciiva.com/22747/443971-22747519.pdf?src-supplier=Element14; ComponentLink4URL: https://datasheet.ciiva.com/46440/1868787-46440891.pdf?src-supplier=Element14; ComponentLink4Description: https://datasheet.ciiva.com/46440/1868787-46440891.pdf?src-supplier=Element14; ComponentLink5URL: https://datasheet.ciiva.com/7746/1738695-7746239.pdf?src-supplier=Element14; ComponentLink5Description: https://datasheet.ciiva.com/7746/1738695-7746239.pdf?src-supplier=Element14; ComponentLink6URL: https://datasheet.ciiva.com/15189/getdatasheetpartid-409289-15189591.pdf?src-supplier=Verical; ComponentLink6Description: https://datasheet.ciiva.com/15189/getdatasheetpartid-409289-15189591.pdf?src-supplier=Verical
S1 = EG1215AA: Slide Switch, SPDT, 0.025A, 24V, SMD; Manufacturer: E-Switch; Mechanical Life: 10000Cycles; Switch Function: On-On; Actuator Type: Standard; Switch Travel: 1.5mm; Operating Force: 150gf; Actuator Length: 1.4mm; Designed By: Arda B.; Supplier: Digi-Key; Supplier Part Number: EG5720CT-ND; Manufacturer Part Number: EG1215AA; RoHS: Yes; Stock: 15895; Pricing: 1=0,99, 10=0,951, 25=0,8884, 100=0,7715, 250=0,702, 500=0,6508, 1000=0,60327 (USD); Mounting Technology: Surface Mount; Min Operating Temperature: -20°C; Max Operating Temperature: 70°C; Throw Configuration: SPDT; Packaging: Cut Tape; Voltage Rating (DC): 24V; Termination: Gull Wing; Electrical Life: 10000Cycles; Series: EG; RoHS Compliant: Yes; ComponentLink1URL: https://media.digikey.com/pdf/Data%20Sheets/E-Switch%20PDFs/EG1215_Series_Ds.pdf?src-supplier=Digi-Key; ComponentLink1Description: https://media.digikey.com/pdf/Data%20Sheets/E-Switch%20PDFs/EG1215_Series_Ds.pdf?src-supplier=Digi-Key; ComponentLink2URL: http://www.farnell.com/datasheets/2645007.pdf?src-supplier=Farnell; ComponentLink2Description: http://www.farnell.com/datasheets/2645007.pdf?src-supplier=Farnell
U4 = STM32F103C6T6A: MCU 32-bit STM32F ARM Cortex M3 RISC 32KB Flash 2.5V/3.3V 48-Pin LQFP Tray; Manufacturer: STMicroelectronics; Number of Timers/Counters: 3; Max Supply Voltage: 3.6V; Interface: I2C,SPI,USART; RAM Size: 10KB; Number of I/Os: 37; Min Supply Voltage: 2V; Data Bus Width: 32b; Clock Frequency: 72MHz; Number of ADC Channels: 10; Designed By: Arda B.; Supplier: Digi-Key; Supplier Part Number: 497-11515-ND; Manufacturer Part Number: STM32F103C6T6A; RoHS: Yes; Category: Microcontrollers; Stock: 1664; Pricing: 1=6,07, 10=5,453, 25=5,1552, 80=4,46775, 250=4,23868, 500=3,80336, 1000=3,20766, 2500=3,04728 (USD); Case/Package: LQFP; Pins: 48; Weight: 0.006409oz; Min Operating Temperature: -40°C; Max Operating Temperature: 85°C; Packaging: Tray; Series: STM32F103C6; Package Quantity: 1500; Memory Format: FLASH; Memory Size: 32KB; Core Architecture: ARM; Length: 7mm; Width: 7mm; Height: 1.4mm; Lead Free: Lead Free; RoHS Compliant: Yes; ComponentLink1URL: https://datasheet.ciiva.com/15122/getdatasheetpartid-69879-15122075.pdf?src-supplier=Verical; ComponentLink1Description: https://datasheet.ciiva.com/15122/getdatasheetpartid-69879-15122075.pdf?src-supplier=Verical; ComponentLink2URL: https://datasheet.ciiva.com/14100/pustm-arm-microcont-stm32f103-en-14100507.pdf?src-supplier=Distrelec; ComponentLink2Description: https://datasheet.ciiva.com/14100/pustm-arm-microcont-stm32f103-en-14100507.pdf?src-supplier=Distrelec
U5 = USBLC6-2SC6: USBLC6 Series 2 Line 6 V Uni / Bi-Directional ESD Protection - SOT-23-6; Manufacturer: STMicroelectronics; Designed By: Arda B.; Direction: Unidirectional,Bidirectional; Value: 3.5pF; Operating Supply Voltage: 1.1V; Number of Channels: 2; Breakdown Voltage: 6V; Clamping Voltage: 17V; Reverse Standoff Voltage: 5.25V; Power Line Protection: Yes; Test Current: 1mA; Max Reverse Leakage Current: 150nA; Peak Pulse Current: 5A; Data Rate: 480Mbps; Number of Elements: 1; Working Voltage: 5V; Supplier: Digi-Key; Supplier Part Number: 497-5235-1-ND; Manufacturer Part Number: USBLC6-2SC6; RoHS: Yes; Category: TVS Diodes; Stock: 49909; Pricing: 1=0,58, 10=0,496, 100=0,3448, 500=0,2692, 1000=0,21881 (USD); Mounting Technology: Surface Mount; Case/Package: SOT-23; Pins: 6; Min Operating Temperature: -40°C; Max Operating Temperature: 125°C; Packaging: Tape and Reel; Package Quantity: 3000; Termination: SMD/SMT; Number of Bidirectional Channels: 2; Min Breakdown Voltage: 6V; ESD Protection: Yes; Leakage Current: 150nA; Series: USB; Reverse Breakdown Voltage: 6V; Polarity: Unidirectional,Bidirectional; Max Breakdown Voltage: 6V; Clamping Voltage-Max: 17V; Length: 3.05mm; Width: 1.75mm; Height: 1.3mm; Depth: 1.75mm; Radiation Hardening: No; Reach SVHC Compliant: No; Lead Free: Lead Free; RoHS Compliant: Yes; ComponentLink1URL: https://datasheet.ciiva.com/1268/1690354-1268384.pdf?src-supplier=Element14; ComponentLink1Description: https://datasheet.ciiva.com/1268/1690354-1268384.pdf?src-supplier=Element14; ComponentLink2URL: https://datasheet.ciiva.com/4508/cd00050750-113117-4508433.pdf?src-supplier=Mouser; ComponentLink2Description: https://datasheet.ciiva.com/4508/cd00050750-113117-4508433.pdf?src-supplier=Mouser; ComponentLink3URL: https://datasheet.ciiva.com/15143/getdatasheetpartid-148465-15143789.pdf?src-supplier=Verical; ComponentLink3Description: https://datasheet.ciiva.com/15143/getdatasheetpartid-148465-15143789.pdf?src-supplier=Verical; ComponentLink4URL: https://datasheet.ciiva.com/16200/cd00050750-16200026.pdf?src-supplier=Future+Electronics; ComponentLink4Description: https://datasheet.ciiva.com/16200/cd00050750-16200026.pdf?src-supplier=Future+Electronics; ComponentLink5URL: https://datasheet.ciiva.com/41444/001184109-da-01-en-ic-esd-protecti-usblc6-2sc6-sot-23-6-stm-41444156.pdf?src-supplier=Conrad; ComponentLink5Description: https://datasheet.ciiva.com/41444/001184109-da-01-en-ic-esd-protecti-usblc6-2sc6-sot-23-6-stm-41444156.pdf?src-supplier=Conrad
U6 = MAX6662MSA+: Temp Sensor Digital Serial (3-Wire, SPI) 8-Pin SOIC N Tube; Manufacturer: Maxim; Designed By: Arda B.; Supplier: Digi-Key; Supplier Part Number: MAX6662MSA+-ND; Manufacturer Part Number: MAX6662MSA+; RoHS: Yes; Category: Temperature and Humidity Sensors; Stock: 593; Pricing: 1=4,61, 10=3,454, 25=3,0704, 50=2,9168, 100=2,8401, 500=2,37956, 1000=2,22604 (USD); ComponentLink1URL: https://datasheet.ciiva.com/5299/max6662-89142-5299456.pdf?src-supplier=Mouser; ComponentLink1Description: https://datasheet.ciiva.com/5299/max6662-89142-5299456.pdf?src-supplier=Mouser; ComponentLink2URL: https://datasheet.ciiva.com/2003/max6662-2003390.pdf?src-supplier=Digi-Key; ComponentLink2Description: https://datasheet.ciiva.com/2003/max6662-2003390.pdf?src-supplier=Digi-Key; ComponentLink3URL: https://datasheet.ciiva.com/3277/max6662-3277979.pdf?src-supplier=Avnet; ComponentLink3Description: https://datasheet.ciiva.com/3277/max6662-3277979.pdf?src-supplier=Avnet
U7 = M41T00M6F: Real-time Clocks Clock/Calendar I2C, 2-Wire Serial 70uA @ 2V ~ 5.5V SOIC-8_150mil RoHS; Manufacturer: STMicroelectronics; Designed By: Arda B.; Supplier: Digi-Key; Supplier Part Number: 497-4697-1-ND; Manufacturer Part Number: M41T00M6F; RoHS: Yes; Category: Real Time Clocks; Stock: 1800; Pricing: 1=3,77, 10=3,388, 25=3,2032, 100=2,776, 250=2,63364, 500=2,36316, 1000=1,99303 (USD); ComponentLink1URL: https://datasheet.ciiva.com/7630/1837112-7630077.pdf?src-supplier=Element14; ComponentLink1Description: https://datasheet.ciiva.com/7630/1837112-7630077.pdf?src-supplier=Element14; ComponentLink2URL: https://datasheet.ciiva.com/16213/cd00001542-16213654.pdf?src-supplier=Future+Electronics; ComponentLink2Description: https://datasheet.ciiva.com/16213/cd00001542-16213654.pdf?src-supplier=Future+Electronics; ComponentLink3URL: https://datasheet.ciiva.com/41459/001185345-da-01-en-ic-rtc-srl-512kbit-m41t00m6f-soic-8-stm-41459818.pdf?src-supplier=Conrad; ComponentLink3Description: https://datasheet.ciiva.com/41459/001185345-da-01-en-ic-rtc-srl-512kbit-m41t00m6f-soic-8-stm-41459818.pdf?src-supplier=Conrad; Min Supply Voltage: 2V; Max Supply Voltage: 5.5V; Min Operating Temperature: -40; Max Operating Temperature: +85
U? = ESP32-WROOM-32N4: Rx Txrx Mod Wifi Surface Mount; Manufacturer: Espressif Systems; Manufacturer Part Number: ESP32-WROOM-32E(M113EH6400PH3Q0); Designed By: Arda B.; Supplier: Digi-Key; Supplier Part Number: 1904-ESP32-WROOM-32E(M113EH6400PH3Q0)TR-ND; RoHS: No; Category: RF Receivers, Transceivers; Pricing: 6500=2,80001 (USD); ComponentLink1Description: Data Sheet; ComponentLink1URL: https://www.st.com/content/ccc/resource/technical/document/datasheet/b3/bb/30/65/78/87/46/ef/CD00001542.pdf/files/CD00001542.pdf/jcr:content/translations/en.CD00001542.pdf; Min Operating Temperature: -40; Max Operating Temperature: +85; Designed-By: Arda B.
X1 = CRYSTAL 16MKHZ: Crystal 16MHz ±30ppm (Tol) ±50ppm (Stability) 20pF FUND 50Ohm 4-Pin Mini-SMD T/R; Manufacturer: ECS International; Designed By: Arda B.; Supplier: Digikey; Supplier Part Number: XC1120CT-ND; Manufacturer Part Number: ECS-160-20-30B-TR; RoHS: Yes; Category: Crystals; Stock: 26135; Pricing: 1=0,75, 10=0,628, 50=0,5648, 100=0,5021, 500=0,47702 (USD); ComponentLink1URL: https://datasheet.ciiva.com/853/ecx-53b-853408.pdf?src-supplier=Digikey; ComponentLink1Description: https://datasheet.ciiva.com/853/ecx-53b-853408.pdf?src-supplier=Digikey; ComponentLink2URL: https://datasheet.ciiva.com/853/ecx-53b-853407.pdf?src-supplier=Digikey; ComponentLink2Description: https://datasheet.ciiva.com/853/ecx-53b-853407.pdf?src-supplier=Digikey; ComponentLink3URL: https://datasheet.ciiva.com/853/ecx-53b-853406.pdf?src-supplier=Digikey; ComponentLink3Description: https://datasheet.ciiva.com/853/ecx-53b-853406.pdf?src-supplier=Digikey
X2 = CRYSTAL 32.768KHZ: CRYSTAL 32.768kHz ±20ppm Crystal 12.5pF 90 kOhm -40°C ^ 85°C Surface Mount 2-SMD; Manufacturer: Abracon; Designed By: Arda B.; ESR (Equivalent Series Resistance): 90kR; Supplier: Digikey; Supplier Part Number: 535-11899-1-ND; Manufacturer Part Number: ABS05-32.768KHZ-T; RoHS: Yes; Category: Crystals; Stock: 145868; Pricing: 1=0,75, 10=0,628, 50=0,565, 100=0,5022, 500=0,4771, 1000=0,40177 (USD); Mounting Technology: Surface Mount; Case/Package: CSMD; Pins: 2; Min Operating Temperature: -40°C; Max Operating Temperature: 85°C; Packaging: Tape and Reel; Frequency Tolerance: 20ppm; Load Capacitance: 12.5pF; Package Quantity: 3000; Frequency: 32.768kHz; Tolerance: 20ppm; Termination: SMD/SMT; ESR: 90kR; Series: ABS05; Operating Frequency: 32.768 kHz; Length: 1.6mm; Width: 1mm; Height: 0.5mm; Depth: 1mm; Radiation Hardening: No; Reach SVHC Compliant: No; Lead Free: Lead Free; RoHS Compliant: Yes; ComponentLink1URL: https://datasheet.ciiva.com/23810/abs05-23810480.pdf?src-supplier=Newark; ComponentLink1Description: https://datasheet.ciiva.com/23810/abs05-23810480.pdf?src-supplier=Newark; ComponentLink2URL: https://datasheet.ciiva.com/6728/abs05-6728949.pdf?src-supplier=Digikey; ComponentLink2Description: https://datasheet.ciiva.com/6728/abs05-6728949.pdf?src-supplier=Digikey; ComponentLink3URL: https://datasheet.ciiva.com/6728/abs05-6728950.pdf?src-supplier=Digikey; ComponentLink3Description: https://datasheet.ciiva.com/6728/abs05-6728950.pdf?src-supplier=Digikey; ComponentLink4URL: https://datasheet.ciiva.com/16411/abs05-16411149.pdf?src-supplier=Future+Electronics; ComponentLink4Description: https://datasheet.ciiva.com/16411/abs05-16411149.pdf?src-supplier=Future+Electronics